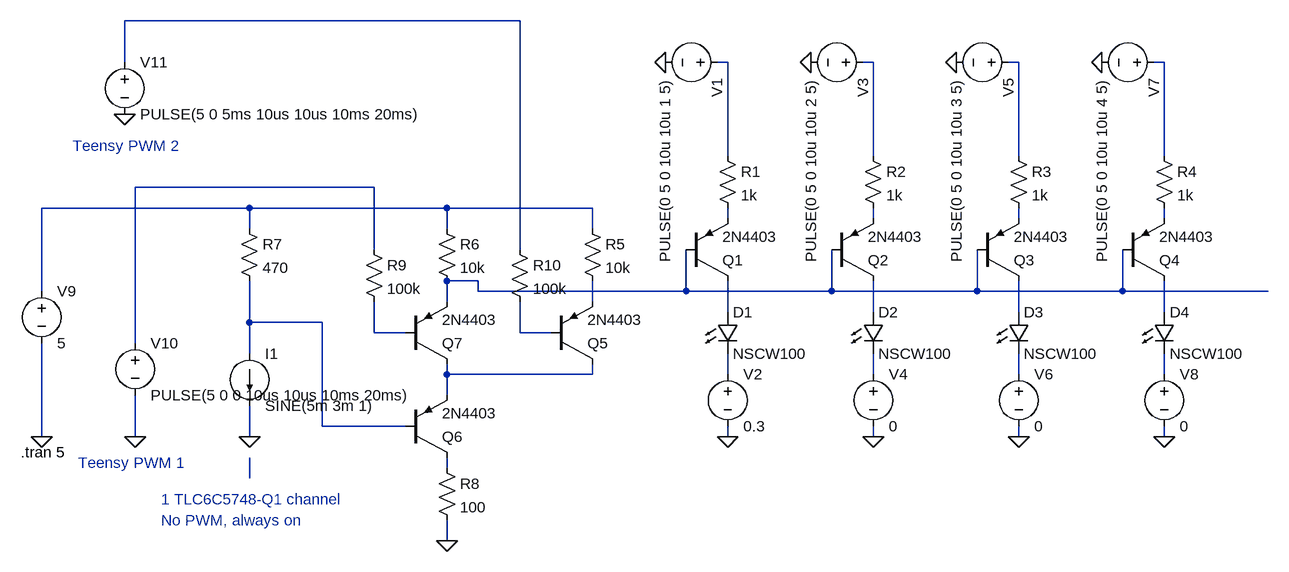
[diagram p0: schematic synchroscope-led-drive.asc]
synchroscope-led-drive.asc, the LTspice schematic file:
Version 4
SHEET 1 1884 680
WIRE -368 -560 -976 -560
WIRE -976 -496 -976 -560
WIRE -48 -496 -64 -496
WIRE 176 -496 160 -496
WIRE 400 -496 384 -496
WIRE 624 -496 608 -496
WIRE -48 -352 -48 -496
WIRE 176 -352 176 -496
WIRE 400 -352 400 -496
WIRE 624 -352 624 -496
WIRE -592 -304 -960 -304
WIRE -784 -272 -1104 -272
WIRE -480 -272 -784 -272
WIRE -256 -272 -480 -272
WIRE -48 -256 -48 -272
WIRE 176 -256 176 -272
WIRE 400 -256 400 -272
WIRE 624 -256 624 -272
WIRE -784 -240 -784 -272
WIRE -480 -240 -480 -272
WIRE -256 -240 -256 -272
WIRE -592 -208 -592 -304
WIRE -368 -208 -368 -560
WIRE -432 -160 -480 -160
WIRE -1104 -144 -1104 -272
WIRE -432 -144 -432 -160
WIRE -112 -144 -112 -208
WIRE -112 -144 -432 -144
WIRE 112 -144 112 -208
WIRE 112 -144 -112 -144
WIRE 336 -144 336 -208
WIRE 336 -144 112 -144
WIRE 560 -144 560 -208
WIRE 560 -144 336 -144
WIRE 784 -144 560 -144
WIRE -480 -128 -480 -160
WIRE -256 -128 -256 -160
WIRE -48 -112 -48 -160
WIRE 176 -112 176 -160
WIRE 400 -112 400 -160
WIRE 624 -112 624 -160
WIRE -784 -96 -784 -160
WIRE -672 -96 -784 -96
WIRE -592 -80 -592 -128
WIRE -544 -80 -592 -80
WIRE -368 -80 -368 -128
WIRE -320 -80 -368 -80
WIRE -960 -64 -960 -304
WIRE -784 -48 -784 -96
WIRE -480 -16 -480 -32
WIRE -256 -16 -256 -32
WIRE -256 -16 -480 -16
WIRE -48 -16 -48 -48
WIRE 176 -16 176 -48
WIRE 400 -16 400 -48
WIRE 624 -16 624 -48
WIRE -480 16 -480 -16
WIRE -672 64 -672 -96
WIRE -544 64 -672 64
WIRE -1104 80 -1104 -64
WIRE -960 80 -960 16
WIRE -784 80 -784 32
WIRE -48 80 -48 64
WIRE 176 80 176 64
WIRE 400 80 400 64
WIRE 624 80 624 64
WIRE -480 128 -480 112
WIRE -784 144 -784 112
WIRE -480 240 -480 208
FLAG -48 80 0
FLAG -144 -496 0
FLAG 176 80 0
FLAG 80 -496 0
FLAG 400 80 0
FLAG 304 -496 0
FLAG 624 80 0
FLAG 528 -496 0
FLAG -784 80 0
FLAG -1104 80 0
FLAG -960 80 0
FLAG -480 240 0
FLAG -976 -416 0
SYMBOL LED -64 -112 R0
SYMATTR InstName D1
SYMATTR Value NSCW100
SYMATTR Description Diode
SYMATTR Type diode
SYMBOL voltage -48 -496 R90
WINDOW 123 0 0 Left 2
WINDOW 39 0 0 Left 2
SYMATTR InstName V1
SYMATTR Value PULSE(0 5 0 10u 10u 1 5)
SYMBOL res -64 -368 R0
SYMATTR InstName R1
SYMATTR Value 1k
SYMBOL pnp -112 -160 M180
SYMATTR InstName Q1
SYMATTR Value 2N4403
SYMBOL voltage -48 -32 R0
WINDOW 123 0 0 Left 2
WINDOW 39 0 0 Left 2
SYMATTR InstName V2
SYMATTR Value 0.3
SYMBOL LED 160 -112 R0
SYMATTR InstName D2
SYMATTR Value NSCW100
SYMATTR Description Diode
SYMATTR Type diode
SYMBOL voltage 176 -496 R90
WINDOW 123 0 0 Left 2
WINDOW 39 0 0 Left 2
SYMATTR InstName V3
SYMATTR Value PULSE(0 5 0 10u 10u 2 5)
SYMBOL res 160 -368 R0
SYMATTR InstName R2
SYMATTR Value 1k
SYMBOL pnp 112 -160 M180
SYMATTR InstName Q2
SYMATTR Value 2N4403
SYMBOL voltage 176 -32 R0
WINDOW 123 0 0 Left 2
WINDOW 39 0 0 Left 2
SYMATTR InstName V4
SYMATTR Value 0
SYMBOL LED 384 -112 R0
SYMATTR InstName D3
SYMATTR Value NSCW100
SYMATTR Description Diode
SYMATTR Type diode
SYMBOL voltage 400 -496 R90
WINDOW 123 0 0 Left 2
WINDOW 39 0 0 Left 2
SYMATTR InstName V5
SYMATTR Value PULSE(0 5 0 10u 10u 3 5)
SYMBOL res 384 -368 R0
SYMATTR InstName R3
SYMATTR Value 1k
SYMBOL pnp 336 -160 M180
SYMATTR InstName Q3
SYMATTR Value 2N4403
SYMBOL voltage 400 -32 R0
WINDOW 123 0 0 Left 2
WINDOW 39 0 0 Left 2
SYMATTR InstName V6
SYMATTR Value 0
SYMBOL LED 608 -112 R0
SYMATTR InstName D4
SYMATTR Value NSCW100
SYMATTR Description Diode
SYMATTR Type diode
SYMBOL voltage 624 -496 R90
WINDOW 123 0 0 Left 2
WINDOW 39 0 0 Left 2
SYMATTR InstName V7
SYMATTR Value PULSE(0 5 0 10u 10u 4 5)
SYMBOL res 608 -368 R0
SYMATTR InstName R4
SYMATTR Value 1k
SYMBOL pnp 560 -160 M180
SYMATTR InstName Q4
SYMATTR Value 2N4403
SYMBOL voltage 624 -32 R0
WINDOW 123 0 0 Left 2
WINDOW 39 0 0 Left 2
SYMATTR InstName V8
SYMATTR Value 0
SYMBOL res -800 -256 R0
SYMATTR InstName R7
SYMATTR Value 470
SYMBOL current -784 -48 R0
WINDOW 123 0 0 Left 2
WINDOW 39 0 0 Left 2
SYMATTR InstName I1
SYMATTR Value SINE(5m 3m 1)
SYMBOL voltage -1104 -160 R0
WINDOW 123 0 0 Left 2
WINDOW 39 0 0 Left 2
SYMATTR InstName V9
SYMATTR Value 5
SYMBOL voltage -960 -80 R0
WINDOW 123 0 0 Left 2
WINDOW 39 0 0 Left 2
SYMATTR InstName V10
SYMATTR Value PULSE(5 0 0 10us 10us 10ms 20ms)
SYMBOL pnp -544 112 M180
SYMATTR InstName Q6
SYMATTR Value 2N4403
SYMBOL res -496 -256 R0
SYMATTR InstName R6
SYMATTR Value 10k
SYMBOL res -496 112 R0
SYMATTR InstName R8
SYMATTR Value 100
SYMBOL pnp -544 -32 M180
SYMATTR InstName Q7
SYMATTR Value 2N4403
SYMBOL res -608 -224 R0
SYMATTR InstName R9
SYMATTR Value 100k
SYMBOL res -272 -256 R0
SYMATTR InstName R5
SYMATTR Value 10k
SYMBOL pnp -320 -32 M180
SYMATTR InstName Q5
SYMATTR Value 2N4403
SYMBOL res -384 -224 R0
SYMATTR InstName R10
SYMATTR Value 100k
SYMBOL voltage -976 -512 R0
WINDOW 123 0 0 Left 2
WINDOW 39 0 0 Left 2
SYMATTR InstName V11
SYMATTR Value PULSE(5 0 5ms 10us 10us 10ms 20ms)
TEXT -1136 104 Left 2 !.tran 5
TEXT -920 176 Left 2 ;1 TLC6C5748-Q1 channel
TEXT -920 208 Left 2 ;No PWM, always on
TEXT -1048 120 Left 2 ;Teensy PWM 1
TEXT -1056 -368 Left 2 ;Teensy PWM 2

The netlist it stands for:
* synchroscope-led-drive.asc
D1 N014 N022 NSCW100
V1 N002 0 PULSE(0 5 0 10u 10u 1 5)
R1 N002 N008 1k
Q1 N014 N012 N008 0 2N4403
V2 N022 0 0.3
D2 N015 N023 NSCW100
V3 N003 0 PULSE(0 5 0 10u 10u 2 5)
R2 N003 N009 1k
Q2 N015 N012 N009 0 2N4403
V4 N023 0 0
D3 N016 N024 NSCW100
V5 N004 0 PULSE(0 5 0 10u 10u 3 5)
R3 N004 N010 1k
Q3 N016 N012 N010 0 2N4403
V6 N024 0 0
D4 N017 N025 NSCW100
V7 N005 0 PULSE(0 5 0 10u 10u 4 5)
R4 N005 N011 1k
Q4 N017 N012 N011 0 2N4403
V8 N025 0 0
R7 N007 N018 470
I1 N018 0 SINE(5m 3m 1)
V9 N007 0 5
V10 N006 0 PULSE(5 0 0 10us 10us 10ms 20ms)
Q6 N026 N018 N021 0 2N4403
R6 N007 N012 10k
R8 N026 0 100
Q7 N021 N019 N012 0 2N4403
R9 N006 N019 100k
R5 N007 N013 10k
Q5 N021 N020 N013 0 2N4403
R10 N001 N020 100k
V11 N001 0 PULSE(5 0 5ms 10us 10us 10ms 20ms)
.model D D
.lib standard.dio
.model NPN NPN
.model PNP PNP
.lib standard.bjt
.tran 5
* 1 TLC6C5748-Q1 channel
* No PWM, always on
* Teensy PWM 1
* Teensy PWM 2
.backanno
.end